# Altium schematic sheet cpld.SchDoc
size A4
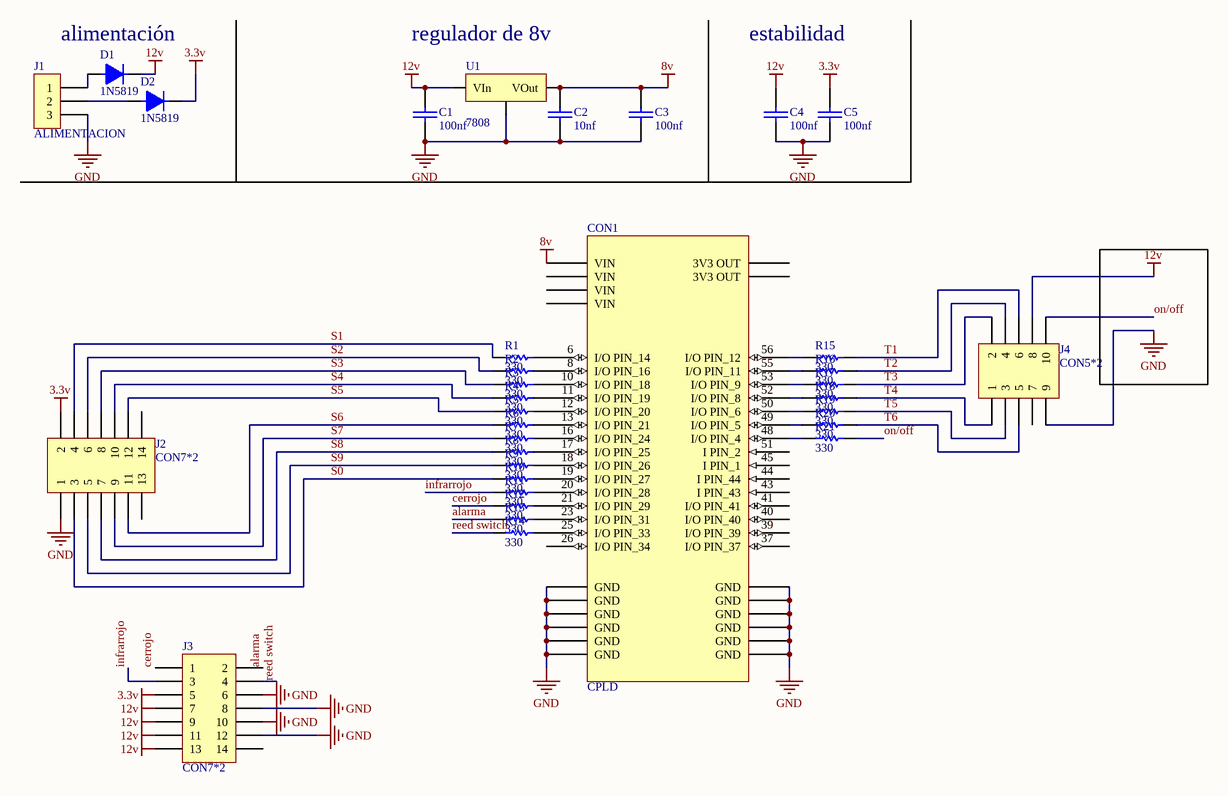
[diagram p0: cpld.SchDoc]

## Parts
C1  100nf  [CAP200]
C2  10nf  [CAP200]
C3  100nf  [CAP200]
C4  100nf  [CAP200]
C5  100nf  [CAP200]
CON1  CPLD  [CPLD_CON]
D1  1N5819  [DO41]
D2  1N5819  [DO41]
J1  ALIMENTACION  [BORNERA3]
J2  CON7*2  [SIP7*2]
J3  CON7*2  [SIP7*2]
J4  CON5*2  [SIP5*2]
R1  330  [RES400]
R2  330  [RES400]
R3  330  [RES400]
R4  330  [RES400]
R5  330  [RES400]
R6  330  [RES400]
R7  330  [RES400]
R8  330  [RES400]
R9  330  [RES400]
R10  330  [RES400]
R11  330  [RES400]
R12  330  [RES400]
R13  330  [RES400]
R14  330  [RES400]
R15  330  [RES400]
R16  330  [RES400]
R17  330  [RES400]
R18  330  [RES400]
R19  330  [RES400]
R20  330  [RES400]
R21  330  [RES400]
U1  7808  [TO-220 V]

## Nets
3.3v: C5.1 D2.2 J2.2 J3.5
8v: C2.1 C3.1 CON1.1(VIN) U1.3(VOut)
12v: C1.1 C4.1 D1.2 J3.7 J3.9 J3.11 J3.13 J4.8 U1.1(VIn)
GND: C1.2 C2.2 C3.2 C4.2 C5.2 CON1.2(GND) CON1.3(GND) CON1.4(GND) CON1.27(GND) CON1.28(GND) CON1.29(GND) CON1.32(GND) CON1.33(GND) CON1.34(GND) CON1.57(GND) CON1.58(GND) CON1.59(GND) J1.3 J2.1 J3.6 J3.8 J3.10 J3.12 J4.9 U1.2(GND)
alarma: J3.2 R13.1
cerrojo: J3.1 R12.1
infrarrojo: J3.3 R11.1
on/off: J4.10 R21.2
reed switch: J3.4 R14.1
S0: J2.3 R10.1
S1: J2.4 R1.1
S2: J2.6 R2.1
S3: J2.8 R3.1
S4: J2.10 R4.1
S5: J2.12 R5.1
S6: J2.11 R6.1
S7: J2.9 R7.1
S8: J2.7 R8.1
S9: J2.5 R9.1
T1: J4.6 R15.2
T2: J4.4 R16.2
T3: J4.2 R17.2
T4: J4.1 R18.2
T5: J4.3 R19.2
T6: J4.5 R20.2
NetCON1_6: CON1.6(I/O_PIN_14) R1.2
NetCON1_8: CON1.8(I/O_PIN_16) R2.2
NetCON1_10: CON1.10(I/O_PIN_18) R3.2
NetCON1_11: CON1.11(I/O_PIN_19) R4.2
NetCON1_12: CON1.12(I/O_PIN_20) R5.2
NetCON1_13: CON1.13(I/O_PIN_21) R6.2
NetCON1_16: CON1.16(I/O_PIN_24) R7.2
NetCON1_17: CON1.17(I/O_PIN_25) R8.2
NetCON1_18: CON1.18(I/O_PIN_26) R9.2
NetCON1_19: CON1.19(I/O_PIN_27) R10.2
NetCON1_20: CON1.20(I/O_PIN_28) R11.2
NetCON1_21: CON1.21(I/O_PIN_29) R12.2
NetCON1_23: CON1.23(I/O_PIN_31) R13.2
NetCON1_25: CON1.25(I/O_PIN_33) R14.2
NetCON1_48: CON1.48(I/O_PIN_4) R21.1
NetCON1_49: CON1.49(I/O_PIN_5) R20.1
NetCON1_50: CON1.50(I/O_PIN_6) R19.1
NetCON1_52: CON1.52(I/O_PIN_8) R18.1
NetCON1_53: CON1.53(I/O_PIN_9) R17.1
NetCON1_55: CON1.55(I/O_PIN_11) R16.1
NetCON1_56: CON1.56(I/O_PIN_12) R15.1
NetD1_1: D1.1 J1.1
NetD2_1: D2.1 J1.2

Not connected (* = marked no-connect by the designer): CON1 14(3V3_OUT) 15(3V3_OUT) 26(I/O_PIN_34) 30(VIN) 31(VIN) 37(I/O_PIN_37) 39(I/O_PIN_39) 40(I/O_PIN_40) 41(I/O_PIN_41) 43(I_PIN_43) 44(I_PIN_44) 45(I_PIN_1) 51(I_PIN_2) 60(VIN); J2 13 14; J3 14; J4 7

## Notes on the sheet
- alimentación
- regulador de 8v
- estabilidad

## Library data of the parts
C1-C5 = CAP
CON1 = CPLD_CON: Conector para Placa PIO CPLD; Autor: AP; Fecha: 03102014
D1 D2 = DIODO
J1 = BORNERA 3
R1-R21 = RES
U1 = 78XX: REGULDOR POSITIVO